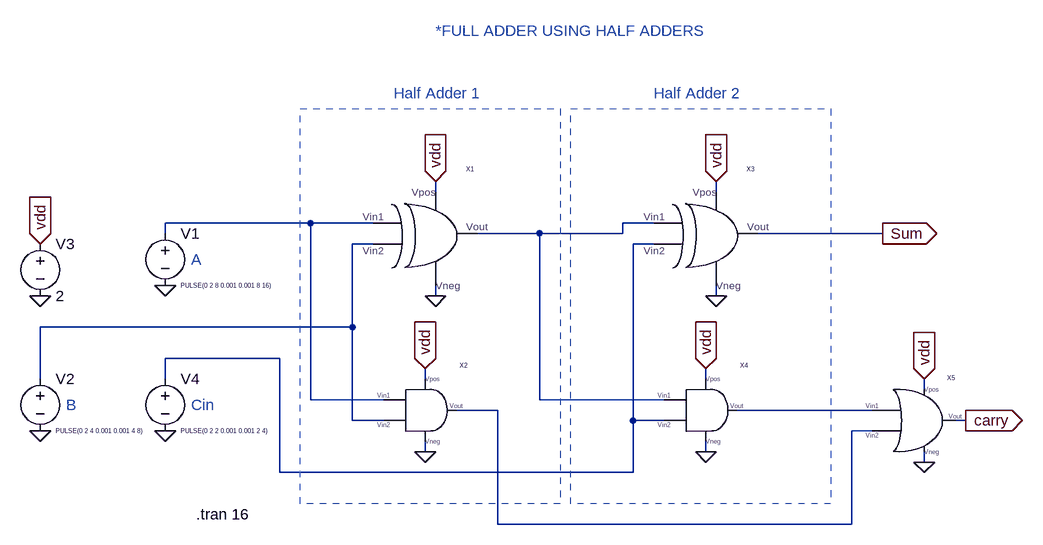
[diagram p0: schematic FA by HA.asc]
FA by HA.asc, the LTspice schematic file:
Version 4
SHEET 1 880 680
WIRE -256 -96 -256 -112
WIRE 176 -96 176 -112
WIRE -448 -48 -672 -48
WIRE -352 -48 -448 -48
WIRE 80 -48 32 -48
WIRE -672 -32 -672 -48
WIRE -96 -32 -192 -32
WIRE 32 -32 32 -48
WIRE 32 -32 -96 -32
WIRE 432 -32 240 -32
WIRE -352 -16 -384 -16
WIRE 80 -16 48 -16
WIRE -256 64 -256 48
WIRE 176 64 176 48
WIRE -384 112 -384 -16
WIRE -384 112 -864 112
WIRE -496 160 -672 160
WIRE -864 192 -864 112
WIRE -672 192 -672 160
WIRE -272 192 -272 176
WIRE 160 192 160 176
WIRE 496 208 496 192
WIRE -448 224 -448 -48
WIRE -336 224 -448 224
WIRE -96 224 -96 -32
WIRE 96 224 -96 224
WIRE -160 240 -224 240
WIRE 416 240 208 240
WIRE -384 256 -384 112
WIRE -336 256 -384 256
WIRE 48 256 48 -16
WIRE 96 256 48 256
WIRE 560 256 544 256
WIRE 416 272 384 272
WIRE -272 304 -272 288
WIRE 160 304 160 288
WIRE 496 320 496 304
WIRE -496 336 -496 160
WIRE 48 336 48 256
WIRE 48 336 -496 336
WIRE -160 416 -160 240
WIRE 384 416 384 272
WIRE 384 416 -160 416
FLAG -672 48 0
FLAG -256 64 0
FLAG -272 304 0
FLAG -864 272 0
FLAG -864 64 0
FLAG -864 -16 vdd
IOPIN -864 -16 In
FLAG -256 -112 vdd
IOPIN -256 -112 In
FLAG -272 176 vdd
IOPIN -272 176 In
FLAG 176 64 0
FLAG 160 304 0
FLAG 176 -112 vdd
IOPIN 176 -112 In
FLAG 160 176 vdd
IOPIN 160 176 In
FLAG 432 -32 Sum
IOPIN 432 -32 Out
FLAG -672 272 0
FLAG 496 192 vdd
IOPIN 496 192 In
FLAG 496 320 0
FLAG 560 256 carry
IOPIN 560 256 Out
SYMBOL xor -208 -48 R0
SYMATTR InstName X1
SYMBOL and -240 240 R0
SYMATTR InstName X2
SYMBOL voltage -672 -48 R0
WINDOW 3 24 96 Left 0
WINDOW 123 0 0 Left 0
WINDOW 39 0 0 Left 0
SYMATTR Value PULSE(0 2 8 0.001 0.001 8 16)
SYMATTR InstName V1
SYMBOL voltage -864 176 R0
WINDOW 3 24 96 Left 0
WINDOW 123 0 0 Left 0
WINDOW 39 0 0 Left 0
SYMATTR Value PULSE(0 2 4 0.001 0.001 4 8)
SYMATTR InstName V2
SYMBOL voltage -864 -32 R0
WINDOW 123 0 0 Left 0
WINDOW 39 0 0 Left 0
SYMATTR InstName V3
SYMATTR Value 2
SYMBOL xor 224 -48 R0
SYMATTR InstName X3
SYMBOL and 192 240 R0
SYMATTR InstName X4
SYMBOL voltage -672 176 R0
WINDOW 3 24 96 Left 0
WINDOW 123 0 0 Left 0
WINDOW 39 0 0 Left 0
SYMATTR Value PULSE(0 2 2 0.001 0.001 2 4)
SYMATTR InstName V4
SYMBOL or 240 256 R0
SYMATTR InstName X5
TEXT -624 400 Left 2 !.tran 16
TEXT -256 -344 Left 2 ;*FULL ADDER USING HALF ADDERS
TEXT -320 -248 Left 2 ;Half Adder 1
TEXT 80 -248 Left 2 ;Half Adder 2
TEXT -632 8 Left 2 ;A
TEXT -824 232 Left 2 ;B
TEXT -632 232 Left 2 ;Cin
RECTANGLE Normal 352 384 -48 -224 1
RECTANGLE Normal -64 384 -464 -224 1

The netlist it stands for:
* FA by HA.asc
XX1 N001 N003 vdd 0 N002 xor  ; pins A B vdd gnd Y
XX2 vdd N001 N003 0 N005 and  ; pins vdd A B gnd Y
V1 N001 0 PULSE(0 2 8 0.001 0.001 8 16)
V2 N003 0 PULSE(0 2 4 0.001 0.001 4 8)
V3 vdd 0 2
XX3 N002 N004 vdd 0 Sum xor  ; pins A B vdd gnd Y
XX4 vdd N002 N004 0 N006 and  ; pins vdd A B gnd Y
V4 N004 0 PULSE(0 2 2 0.001 0.001 2 4)
XX5 vdd N006 N005 0 carry or  ; pins vdd A B gnd Y
.tran 16
* *FULL ADDER USING HALF ADDERS
* Half Adder 1
* Half Adder 2
* A
* B
* Cin
.backanno
.end